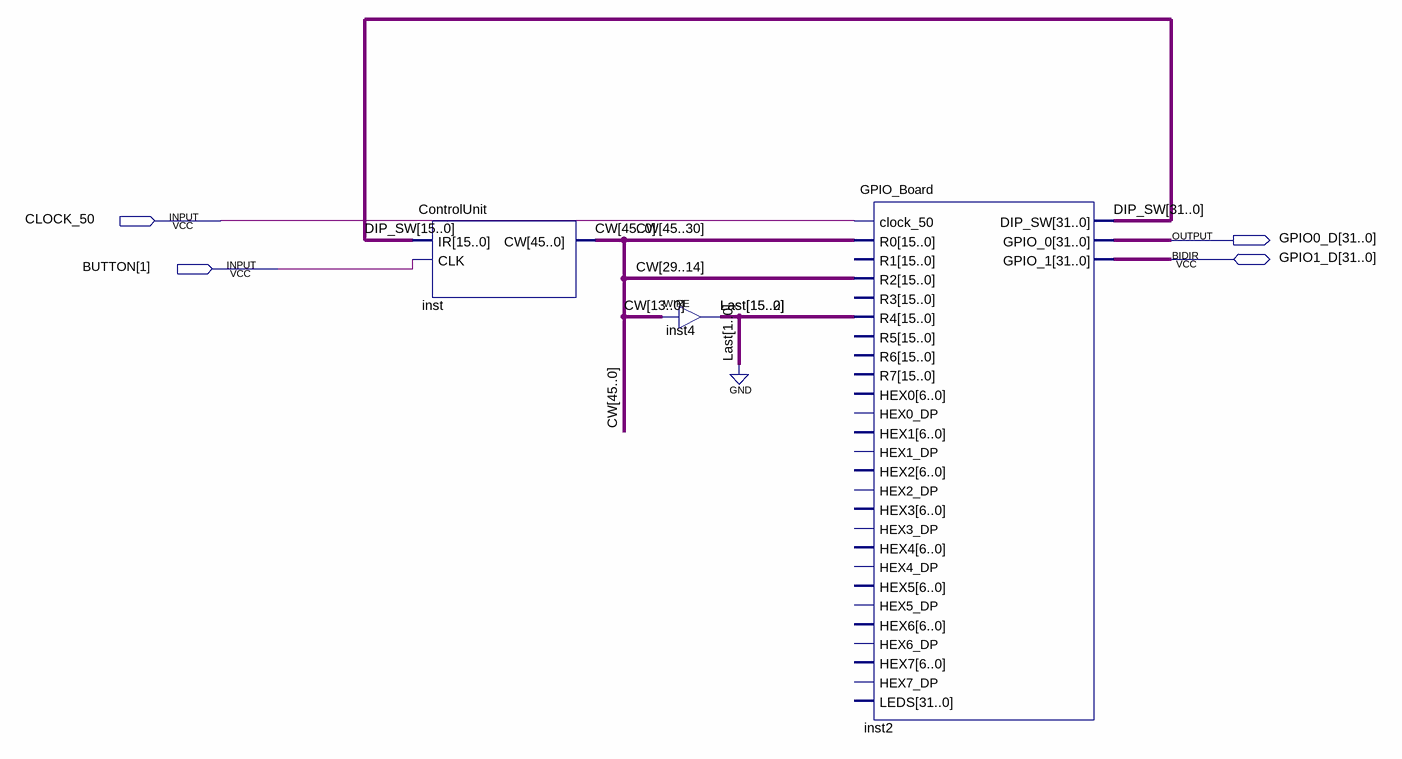
[diagram p0: schematic sheet]
// Quartus schematic ControlUnitGPIO.bdf as structural Verilog: 3 symbols, 4 pins
module ControlUnitGPIO (
  input  CLOCK_50,
  input  [1:1] BUTTON,
  inout  [31:0] GPIO1_D,
  output [31:0] GPIO0_D
);

  wire [15:2] Last;
  wire [31:0] DIP_SW;
  wire [45:0] CW;

  ControlUnit inst (.IR(DIP_SW[15:0]), .CLK(BUTTON[1]), .CW(CW));
  assign Last = CW[13:0];  // WIRE inst4
  GPIO_Board inst2 (
    .clock_50(CLOCK_50), .R0(CW[45:30]), .R2(CW[29:14]), .R4({Last, 2'b00}), .DIP_SW(DIP_SW),
    .GPIO_0(GPIO0_D), .GPIO_1(GPIO1_D));  // open: R1, R3, R5, R6, R7, HEX0, HEX0_DP, HEX1, HEX1_DP, HEX2, HEX2_DP, HEX3, HEX3_DP, HEX4, HEX4_DP, HEX5, HEX5_DP, HEX6, HEX6_DP, HEX7, HEX7_DP, LEDS
endmodule
